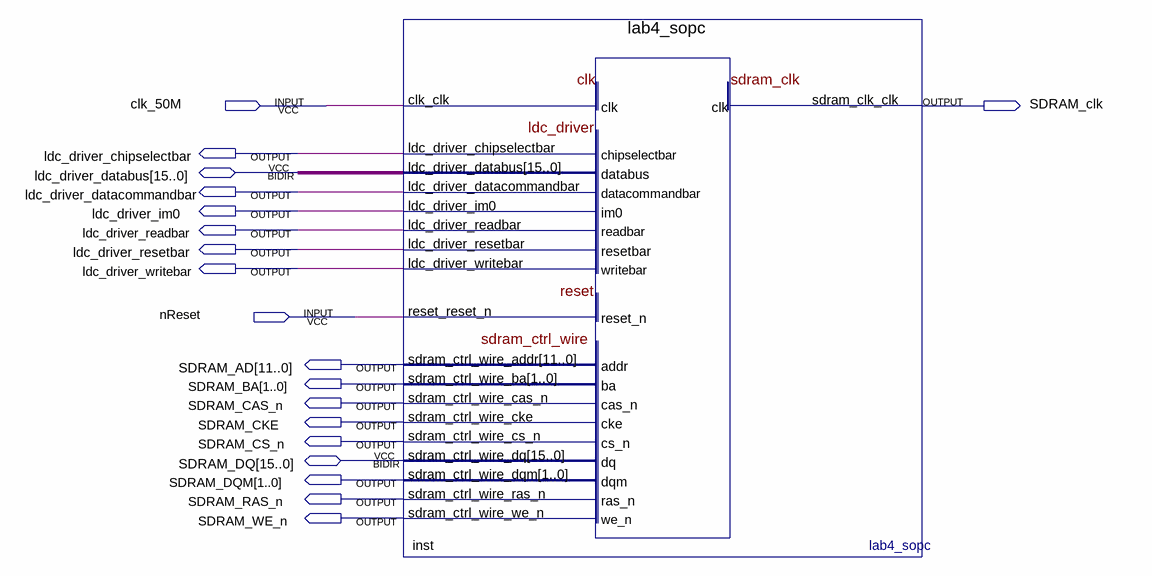
[diagram p0: schematic sheet]
// Quartus schematic lab4_ldcDriver.bdf as structural Verilog: 1 symbols, 19 pins
module lab4_ldcDriver (
  input  clk_50M,
  input  nReset,
  inout  [15:0] ldc_driver_databus,
  inout  [15:0] SDRAM_DQ,
  output SDRAM_clk,
  output ldc_driver_chipselectbar,
  output ldc_driver_datacommandbar,
  output ldc_driver_im0,
  output ldc_driver_readbar,
  output ldc_driver_resetbar,
  output ldc_driver_writebar,
  output [11:0] SDRAM_AD,
  output [1:0] SDRAM_BA,
  output SDRAM_CAS_n,
  output SDRAM_CKE,
  output SDRAM_CS_n,
  output [1:0] SDRAM_DQM,
  output SDRAM_RAS_n,
  output SDRAM_WE_n
);

  lab4_sopc inst (
    .clk_clk(clk_50M), .reset_reset_n(nReset), .ldc_driver_chipselectbar(ldc_driver_chipselectbar),
    .ldc_driver_datacommandbar(ldc_driver_datacommandbar), .ldc_driver_im0(ldc_driver_im0),
    .ldc_driver_readbar(ldc_driver_readbar), .ldc_driver_resetbar(ldc_driver_resetbar),
    .ldc_driver_writebar(ldc_driver_writebar), .sdram_clk_clk(SDRAM_clk), .sdram_ctrl_wire_addr(SDRAM_AD),
    .sdram_ctrl_wire_ba(SDRAM_BA), .sdram_ctrl_wire_cas_n(SDRAM_CAS_n), .sdram_ctrl_wire_cke(SDRAM_CKE),
    .sdram_ctrl_wire_cs_n(SDRAM_CS_n), .sdram_ctrl_wire_dqm(SDRAM_DQM), .sdram_ctrl_wire_ras_n(SDRAM_RAS_n),
    .sdram_ctrl_wire_we_n(SDRAM_WE_n), .ldc_driver_databus(ldc_driver_databus), .sdram_ctrl_wire_dq(SDRAM_DQ));
endmodule
